# Altium schematic sheet ARM_PWR.SchDoc: Title
size A4; Date: *******; ApprovedBy: *******; CheckedBy: None; Author: *******; CompanyName: *******; DrawnBy: Jacob Chisholm; Engineer: *******; Organization: *******; Address1: *******; Address2: *******; Address3: *******; Address4: *******; DocumentNumber: 5; Revision: *******; SheetNumber: 5; SheetTotal: 9; Address_Website: https://jchisholm204.github.io; E-Mail: JacobChisholm1010@gmail.com; CurrentTime: *******; CurrentDate: *******; Time: *******; DocumentFullPathAndName: *******; DocumentName: *******; ModifiedDate: *******; ImagePath: *******; ProjectName: *******; Application_BuildNumber: *******
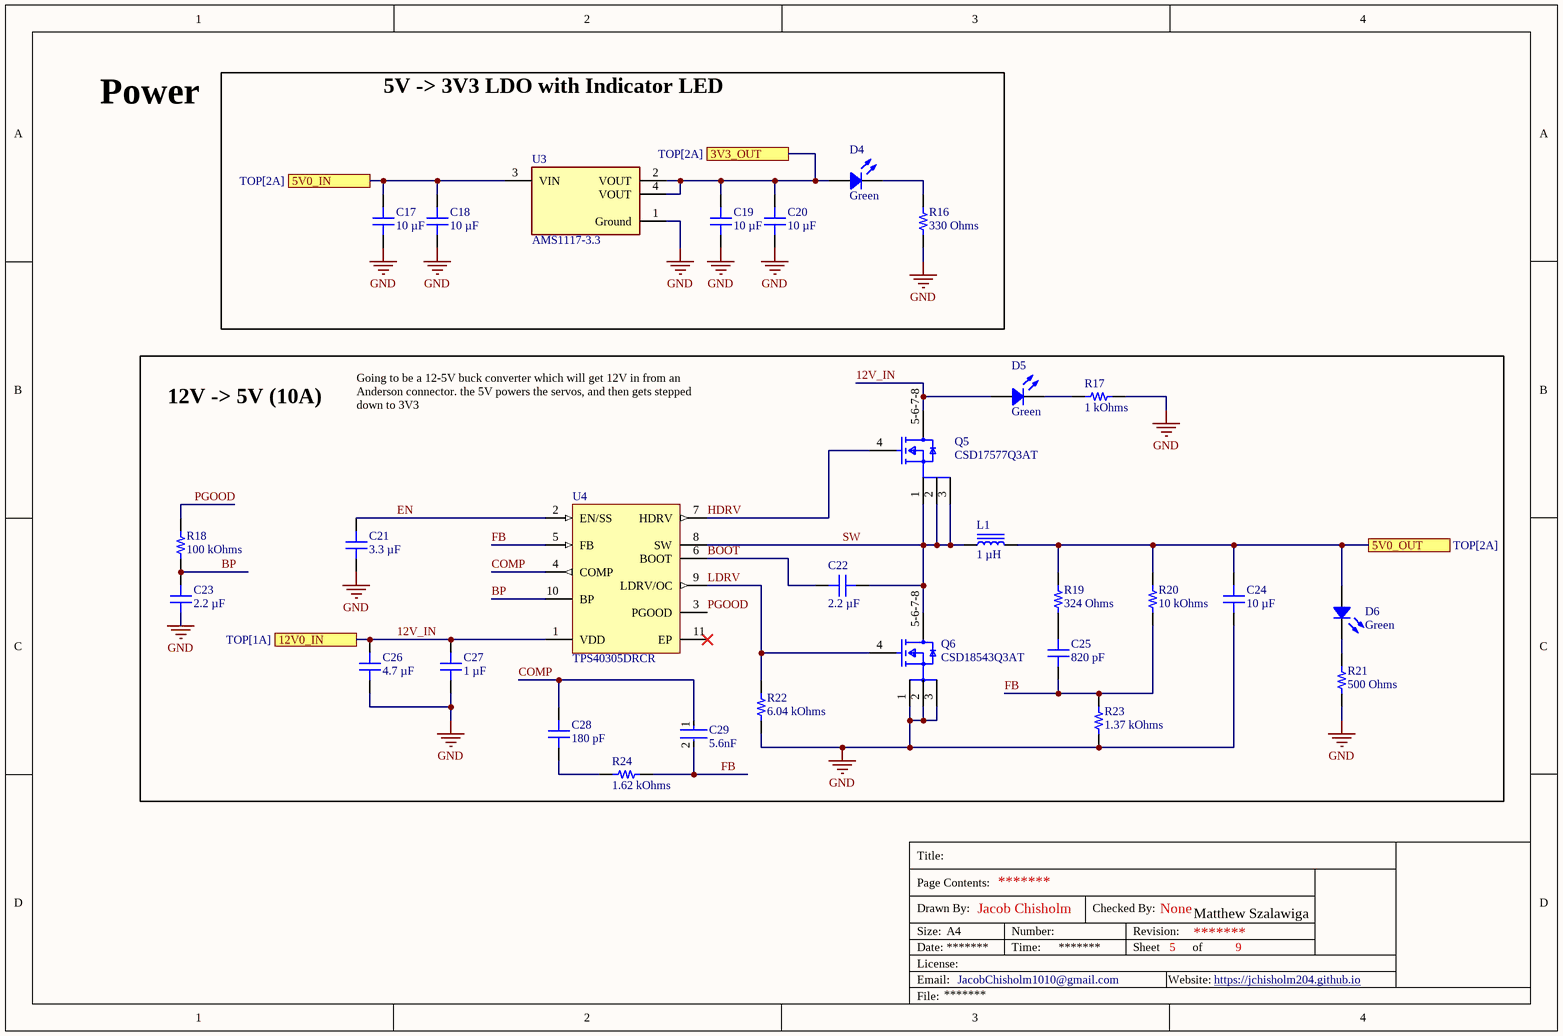
[diagram p0: ARM_PWR.SchDoc]

## Parts
C17  10 µF  [CAP 0603_1608]
C18  10 µF  [CAP 0603_1608]
C19  10 µF  [CAP 0603_1608]
C20  10 µF  [CAP 0603_1608]
C21  3.3 µF  [CAP 0603_1608]
C22  2.2 µF  [CAP 0603_1608]
C23  2.2 µF  [CAP 0603_1608]
C24  10 µF  [CAP 0603_1608]
C25  820 pF  [CAP 0603_1608]
C26  4.7 µF  [CAP 0603_1608]
C27  1 µF  [CAP 0603_1608]
C28  180 pF  [CAP 0603_1608]
C29  5.6nF  [FP-CGA4J-IPC_B]
D4  Green  [LED 0603_1608 GREEN]
D5  Green  [LED 0603_1608 GREEN]
D6  Green  [LED 0603_1608 GREEN]
L1  1 µH  [WURTH WE-HCI 7040]
Q5  CSD17577Q3AT  [FP-DNH0008A-MFG]
Q6  CSD18543Q3AT  [FP-DNH0008A-MFG]
R16  330 Ohms  [RES 0603_1608]
R17  1 kOhms  [RES 0603_1608]
R18  100 kOhms  [RES 0603_1608]
R19  324 Ohms  [RES 0603_1608]
R20  10 kOhms  [RES 0603_1608]
R21  500 Ohms  [RES 0603_1608]
R22  6.04 kOhms  [RES 0603_1608]
R23  1.37 kOhms  [RES 0603_1608]
R24  1.62 kOhms  [RES 0603_1608]
U3  AMS1117-3.3  [FP-AMS1117-IPC_C]
U4  TPS40305DRCR  [DRC0010J_V]

## Blocks framed on the sheet
5V -> 3V3 LDO with Indicator LED: C17-C20 D4 R16 U3
12V -> 5V (10A): C21-C29 D5 D6 L1 Q5 Q6 R17-R24 U4

## Ports
3V3_OUT (see TOP[2A]), 5V0_IN (see TOP[2A]), 5V0_OUT (see TOP[2A]), 12V0_IN (see TOP[1A])

## Nets
GND: C17.1 C18.1 C19.1 C20.1 C21.1 C23.1 C24.1 C26.1 C27.1 Q6.1(S) Q6.2(S) Q6.3(S) R16.1 R17.2 R21.1 R22.1 R23.1 U3.1(Ground)
3V3_OUT: C19.2 C20.2 D4.1 U3.2(VOUT) U3.4(VOUT) ; port 3V3_OUT
5V0_IN: C17.2 C18.2 U3.3(VIN) ; port 5V0_IN
5V0_OUT: C24.2 D6.1 L1.2 R19.2 R20.2 ; port 5V0_OUT
12V_IN: C26.2 C27.2 D5.1 Q5.5-6-7-8(D) U4.1(VDD) ; port 12V0_IN
BOOT: C22.1 U4.6(BOOT)
BP: C23.2 R18.1 U4.10(BP)
COMP: C28.2 C29.1 U4.4(COMP)
EN: C21.2 U4.2(EN/SS)
FB: C25.1 C29.2 R20.1 R23.2 R24.2 U4.5(FB)
HDRV: Q5.4(G) U4.7(HDRV)
LDRV: Q6.4(G) R22.2 U4.9(LDRV/OC)
PGOOD: R18.2 U4.3(PGOOD)
SW: C22.2 L1.1 Q5.1(S) Q5.2(S) Q5.3(S) Q6.5-6-7-8(D) U4.8(SW)
NetC25_2: C25.2 R19.1
NetC28_1: C28.1 R24.1
NetD4_2: D4.2 R16.2
NetD5_2: D5.2 R17.1
NetD6_2: D6.2 R21.2

Not connected (* = marked no-connect by the designer): U4 11(EP)*

## Notes on the sheet
- Power
- Going to be a 12-5V buck converter which will get 12V in from an Anderson connector. the 5V powers the servos, and then gets stepped down to 3V3
- Matthew Szalawiga
- Title:
- Drawn By:
- Page Contents:
- Checked By:
- Size:
- Date:
- File:
- License:
- Email:
- A4
- Number:
- Time:
- Revision:
- Sheet
- Website:
- of

## Library data of the parts
C17-C20 C24 = CM105X5R106K16AT: 0603 X5R 10UF10% 16V; manufacturer: KYOCERA AVX; Tolerance: ±10%; Part Number: CM105X5R106K16AT; Value: 10 µF; Applications: General Purpose; Capacitance: 10 µF; componentlink1description: Datasheet; componentlink1url: https://ele.kyocera.com/assets/products/capacitor/CM_Series_e.pdf; componentlink2description: DigiKey Link; componentlink2url: https://www.digikey.com/en/products/detail/kyocera-avx/CM105X5R106K16AT/17866311; Device Package: 0603 (1608 Metric); lastupdated: 2/9/2024 8:08:53 PM; Lifecycle Status: Active; Minimum Order: 1; Mounting Type: Surface Mount, MLCC; Operating Temperature: -55°C ~ 85°C; Package / Case: 0603 (1608 Metric); packaging: TapeAndReel; partid: 55416; Part Status: Active; price: 0.03; series: CM; Size / Dimension: 0.063" L x 0.031" W (1.60mm x 0.80mm); Supplier 1: DigiKey; Supplier Part Number 1: 478-CM105X5R106K16ATCT-ND; Temperature Coefficient: X5R; Thickness (Max): 0.039" (1.00mm); Voltage - Rated: 16V
C21 = C0603C335K9PAC7867: CAP CER 3.3UF 6.3V X5R 0603; manufacturer: KEMET; Tolerance: ±10%; Part Number: C0603C335K9PAC7867; Value: 3.3 µF; Applications: Bypass, Decoupling; Capacitance: 3.3 µF; componentlink1description: Datasheet; componentlink1url: //media.digikey.com/pdf/Data%20Sheets/Kemet%20PDFs/X5R_Dielectric_Rev_Nov2016.pdf; componentlink2description: DigiKey Link; componentlink2url: https://www.digikey.com/en/products/detail/kemet/C0603C335K9PAC7867/754743; Device Package: 0603 (1608 Metric); lastupdated: 2/9/2024 8:10:21 PM; Lifecycle Status: Active; Minimum Order: 1; Mounting Type: Surface Mount, MLCC; Operating Temperature: -55°C ~ 85°C; Package / Case: 0603 (1608 Metric); packaging: TapeAndReel; partid: 9662; Part Status: Active; price: 0.04; series: SMD Comm X5R; Size / Dimension: 0.063" L x 0.031" W (1.60mm x 0.80mm); Supplier 1: DigiKey; Supplier Part Number 1: 399-3481-1-ND; Temperature Coefficient: X5R; Thickness (Max): 0.035" (0.90mm); Voltage - Rated: 6.3V
C22 C23 = 06033D225KAT2A: 0603 25V X5R 2.2UF 10%; manufacturer: KYOCERA AVX; Part Number: 06033D225KAT2A; Value: 2.2 µF; Applications: General Purpose; Capacitance: 2.2 µF; componentlink1description: Datasheet; componentlink1url: https://datasheets.kyocera-avx.com/cx5r.pdf; componentlink2description: DigiKey Link; componentlink2url: https://www.digikey.com/en/products/detail/kyocera-avx/06033D225KAT2A/17868586; Device Package: 0603 (1608 Metric); lastupdated: 2/9/2024 8:09:42 PM; Lifecycle Status: Active; Minimum Order: 1; Mounting Type: Surface Mount, MLCC; Operating Temperature: -55°C ~ 85°C; Package / Case: 0603 (1608 Metric); packaging: TapeAndReel; partid: 48576; Part Status: Active; price: 0.07; series: -; Size / Dimension: 0.063" L x 0.032" W (1.60mm x 0.81mm); Supplier 1: DigiKey; Supplier Part Number 1: 478-06033D225KAT2ACT-ND; Temperature Coefficient: X5R; Thickness (Max): 0.037" (0.94mm); Tolerance: ±10%; Voltage - Rated: 25V
C25 = C0603C821J4HAC7867: CAP CER 820PF 16V X8R 0603; manufacturer: KEMET; Tolerance: ±5%; Part Number: C0603C821J4HAC7867; Value: 820 pF; Applications: General Purpose; Capacitance: 820 pF; componentlink1description: Datasheet; componentlink1url: https://connect.kemet.com:7667/gateway/IntelliData-ComponentDocumentation/1.0/download/datasheet/C0603C821J4HAC7867; componentlink2description: DigiKey Link; componentlink2url: https://www.digikey.com/en/products/detail/kemet/C0603C821J4HAC7867/7946714; Device Package: 0603 (1608 Metric); Features: Low ESL, High Temperature; lastupdated: 2/9/2024 8:08:42 PM; Lifecycle Status: Active; Minimum Order: 1; Mounting Type: Surface Mount, MLCC; Operating Temperature: -55°C ~ 150°C; Package / Case: 0603 (1608 Metric); packaging: TapeAndReel; partid: 56225; price: 0.01; series: SMD Comm X8R HT150C; Size / Dimension: 0.063" L x 0.031" W (1.60mm x 0.80mm); Supplier 1: DigiKey; Supplier Part Number 1: 399-C0603C821J4HAC7867CT-ND; Temperature Coefficient: X8R; Thickness (Max): 0.034" (0.87mm); Voltage - Rated: 16V
C26 = GMC10X5R475K25NT: CAP0603 X5R 4.7UF 10% 25V; manufacturer: Cal-Chip Electronics, Inc.; Part Number: GMC10X5R475K25NT; Value: 4.7 µF; Applications: General Purpose; Capacitance: 4.7 µF; componentlink1description: Datasheet; componentlink1url: https://88ce57.p3cdn1.secureserver.net/wp-content/uploads/2023/01/gmc_series-2.pdf; componentlink2description: DigiKey Link; componentlink2url: https://www.digikey.com/en/products/detail/cal-chip-electronics-inc/GMC10X5R475K25NT/18151165; Device Package: 0603 (1608 Metric); lastupdated: 2/9/2024 8:09:39 PM; Lifecycle Status: Active; Minimum Order: 1; Mounting Type: Surface Mount, MLCC; Operating Temperature: -55°C ~ 85°C; Package / Case: 0603 (1608 Metric); packaging: TapeAndReel; partid: 49827; Part Status: Active; price: 0.03; series: GMC; Size / Dimension: 0.063" L x 0.031" W (1.60mm x 0.80mm); Supplier 1: DigiKey; Supplier Part Number 1: 4713-GMC10X5R475K25NTCT-ND; Temperature Coefficient: X5R; Thickness (Max): 0.039" (1.00mm); Tolerance: ±10%; Voltage - Rated: 25V
C27 = GMC10X7R105K50NT: CAP0603 X7R 1UF 10% 50V; manufacturer: Cal-Chip Electronics, Inc.; Part Number: GMC10X7R105K50NT; Value: 1 µF; Applications: General Purpose; Capacitance: 1 µF; componentlink1description: Datasheet; componentlink1url: https://88ce57.p3cdn1.secureserver.net/wp-content/uploads/2023/01/gmc_series-2.pdf; componentlink2description: DigiKey Link; componentlink2url: https://www.digikey.com/en/products/detail/cal-chip-electronics-inc/GMC10X7R105K50NT/18151141; Device Package: 0603 (1608 Metric); lastupdated: 2/9/2024 8:09:39 PM; Lifecycle Status: Active; Minimum Order: 1; Mounting Type: Surface Mount, MLCC; Operating Temperature: -55°C ~ 125°C; Package / Case: 0603 (1608 Metric); packaging: TapeAndReel; partid: 49828; Part Status: Active; price: 0.03; series: GMC; Size / Dimension: 0.063" L x 0.031" W (1.60mm x 0.80mm); Supplier 1: DigiKey; Supplier Part Number 1: 4713-GMC10X7R105K50NTCT-ND; Temperature Coefficient: X7R; Thickness (Max): 0.037" (0.95mm); Tolerance: ±10%; Voltage - Rated: 50V
C28 = VJ0603A181GXQCW1BC: CAP CER 180PF 10V C0G/NP0 0603; manufacturer: Vishay Vitramon; Temperature Coefficient: C0G, NP0; Tolerance: ±2%; Part Number: VJ0603A181GXQCW1BC; Value: 180 pF; Applications: General Purpose; Capacitance: 180 pF; componentlink1description: Datasheet; componentlink1url: https://www.vishay.com/docs/28548/vjw1bcbascomseries.pdf; componentlink2description: DigiKey Link; componentlink2url: https://www.digikey.com/en/products/detail/vishay-vitramon/VJ0603A181GXQCW1BC/8303297; Device Package: 0603 (1608 Metric); lastupdated: 2/9/2024 8:09:53 PM; Lifecycle Status: Active; Minimum Order: 1; Mounting Type: Surface Mount, MLCC; Operating Temperature: -55°C ~ 125°C; Package / Case: 0603 (1608 Metric); packaging: TapeAndReel; partid: 34229; Part Status: Active; price: 0.02; series: VJ W1BC; Size / Dimension: 0.063" L x 0.031" W (1.60mm x 0.80mm); Supplier 1: DigiKey; Supplier Part Number 1: 720-VJ0603A181GXQCW1BCCT-ND; Thickness (Max): 0.034" (0.87mm); Voltage - Rated: 10V
C29 = CMP-08246-002383-1: Cap Ceramic 5.6nF 50V C0G 5% Pad SMD 0805 +125°C Automotive T/R; Max Operating Temperature: 125°C; Width: 0.049inch; Ratings: AEC-Q200; Voltage Rating: 50V; Dielectric: C0G; Capacitance: 5.6nF; Length: 2mm; Min Operating Temperature: -55°C; Packaging: Tape and Reel; Thickness: 0.028inch; Mount: Surface Mount; Case/Package: 0805; Composition: Ceramic; Voltage Rating (DC): 50V; Case Code (Metric): 2012; REACH SVHC: No SVHC; Package Quantity: 1; Height: 0.6mm; Tolerance: 5%; Termination: SMD/SMT; Weight: 0.000194oz; Depth: 1.25mm; Case Code (Imperial): 0805
D4-D6 = 150060GS75003: LED GREEN CLEAR 0603 SMD; Manufacturer: Würth Elektronik; Current - Test: 20mA; Lens Color: Colorless; Lens Size: 1.10mm x 0.80mm; Lens Style: Rectangle with Flat Top; Millicandela Rating: 1600mcd; Viewing Angle: 140°; Voltage - Forward (Vf) (Typ): 3.2V; Wavelength - Dominant: 525nm; Wavelength - Peak: 515nm; Part Number: 150060GS75003; Color: Green; ComponentLink1Description: Datasheet; ComponentLink1URL: https://www.we-online.com/catalog/datasheet/150060GS75003.pdf; ComponentLink2Description: DigiKey Link; ComponentLink2URL: https://www.digikey.com/en/products/detail/würth-elektronik/150060GS75003/16022170; Device Package: 0603 (1608 Metric); Height (Max): 0.80mm; LastUpdated: 6/3/2024 7:58:49 PM; Lens Transparency: Clear; Lifecycle Status: Active; Minimum Order: 1; Mounting Type: Surface Mount; Package / Case: 0603 (1608 Metric); Packaging: TapeAndReel; PartId: 1111; Part Status: Active; Price: 0.18; Series: WL-SMCW; Size / Dimension: 1.60mm L x 0.80mm W; Supplier 1: DigiKey; Supplier Part Number 1: 732-150060GS75003CT-ND; Supplier Device Package: 0603; Value: Green
L1 = 744311100: FIXED IND 1UH 15A 4.6 MOHM SMD; Manufacturer: Würth Elektronik; Current - Saturation: 19A; Frequency - Self Resonant: 85MHz; Inductance Frequency - Test: 100 kHz; Material - Core: Nonstandard; Shielding: Shielded; Tolerance: ±20%; Type: Wirewound; Part Number: 744311100; ComponentLink1Description: Datasheet; ComponentLink1URL: https://katalog.we-online.de/pbs/datasheet/744311100.pdf; ComponentLink2Description: DigiKey Link; ComponentLink2URL: https://www.digikey.com/en/products/detail/würth-elektronik/744311100/3476747; Current Rating (Amps): 15 A; DC Resistance (DCR): 4.6mOhm; Device Package: Nonstandard; Height - Seated (Max): 0.157" (4.00mm); Inductance: 1 µH; LastUpdated: 6/3/2024 8:02:48 PM; Lifecycle Status: Active; Minimum Order: 1; Mounting Type: Surface Mount; Operating Temperature: -40°C ~ 150°C; Package / Case: Nonstandard; Packaging: TapeAndReel; PartId: 260; Part Status: Active; Price: 2.72; Ratings: AEC-Q200; Series: WE-HCI; Size / Dimension: 0.276" L x 0.272" W (7.00mm x 6.90mm); Supplier 1: DigiKey; Supplier Part Number 1: 732-4177-1-ND; Supplier Device Package: 7040; Value: 1 µH
Q5 = CMP-04962-000094-1: MOSFET N-CH 30V 35A 8VSON; Number of Elements: 1; Continuous Drain Current (ID): 19A; Turn-On Delay Time: 4ns; Power Dissipation: 2.8W; Drain to Source Resistance: 5.3mR; Turn-Off Delay Time: 20ns; Max Power Dissipation: 53W; Gate to Source Voltage (Vgs): 20V; Input Capacitance: 2.31nF; Threshold Voltage: 1.4V; Element Configuration: Single; Rds On Max: 4.8mR; Rise Time: 31ns; Number of Pins: 8; RoHS Compliant: Yes; Fall Time: 4ns; Lead Free: Lead Free; Number of Channels: 1; Packaging: Tape and Reel; REACH SVHC: No SVHC; Package Quantity: 250; Drain to Source Voltage (Vdss): 30V; Contact Plating: Tin; Max Operating Temperature: 150°C; Min Operating Temperature: -40°C; Mount: Surface Mount
Q6 = CMP-04962-000006-1: 60V N-CHANNEL NEXFET POWER MOSF; Manufacturer: Texas Instruments; Turn On Delay Time: 9ns; Number Of Channels: 1; Reverse Recovery Charge: 37nC; Continuous Drain Current: 12A; Pulse Drain Current: 156A; Typ Forward Diode Voltage: 0.8V; Gate Charge At Vgs: 11.1nC @ 10V; Depletion Mode: False; Transconductance: 40S; Threshold Vgs Min: 1.5V; Max Forward Diode Voltage: 1V; Turn Off Delay Time: 8ns; Threshold Vgs Max: 2.7V; Power Dissipation: 2.8W; Max Junction Temp: +150°C; Reverse Recovery Time: 27ns; Drain To Source Resistance: 8.1mΩ; Standoff Height: 0mm; Rthja Max: 55°C/W; Input Capacitace At Vds: 885pF @ 30V; Gate To Source Voltage: 20V; Device Class L1: Discrete Semiconductors; ComponentLink2Description: Datasheet; Drain To Source Voltage: 60V; Mouser Description: Transistor: N-MOSFET; unipolar; 60V; 35A; 66W; VSONP8 3, 3x3, 3mm; RoHS: TRUE; Manufacturer Part Number: CSD18543Q3AT; Digikey Description: 60V N-CHANNEL NEXFET POWER MOSF; Lead Free: Yes; Height: 0.9mm; Device Class L3: MOSFETs; Number Of N Channels: 1; Drain To Source Breakdown Voltage: 60V; Category: Trans; Automotive: No; Package: DNH0008A; Octopart: https://octopart.com/csd18543q3at-texas+instruments-77040189; Temperature Range Low: -55°C; Device Class L2: Transistors; Temperature: -55°C to +150°C; Temperature Range High: +150°C; ComponentLink2URL: http://www.ti.com/lit/ds/symlink/csd18543q3a.pdf
R16 = ERA-3VEB3300V: RES 330 OHM 0.1% 1/8W 0603; Manufacturer: Panasonic Electronic Components; Power (Watts): 0.125W, 1/8W; Temperature Coefficient: ±25ppm/°C; Part Number: ERA-3VEB3300V; Value: 330 Ohms; ComponentLink1Description: Datasheet; ComponentLink1URL: https://b2b-api.panasonic.eu/file_stream/pids/fileversion/9152; ComponentLink2Description: DigiKey Link; ComponentLink2URL: https://www.digikey.com/en/products/detail/panasonic-electronic-components/ERA-3VEB3300V/12085193; Composition: Thin Film; Device Package: 0603 (1608 Metric); Features: Anti-Sulfur, Automotive AEC-Q200; Height - Seated (Max): 0.022" (0.55mm); LastUpdated: 2/9/2024 8:41:22 PM; Lifecycle Status: Active; Minimum Order: 1; Number of Terminations: 2; Operating Temperature: -55°C ~ 155°C; Package / Case: 0603 (1608 Metric); Packaging: TapeAndReel; PartId: 62303; Part Status: Active; Price: 0.10; Ratings: AEC-Q200; Resistance: 330 Ohms; Series: ERA-3V; Size / Dimension: 0.063" L x 0.031" W (1.60mm x 0.80mm); Supplier 1: DigiKey; Supplier Part Number 1: 10-ERA-3VEB3300VCT-ND; Supplier Device Package: 0603; Tolerance: ±0.1%
R17 = APC0603B1K00N: 1/16 WATTS PRECISION CHIP 1 KILO; Manufacturer: Ohmite; Power (Watts): 0.063W, 1/16W; Temperature Coefficient: ±25ppm/°C; Tolerance: ±0.1%; Part Number: APC0603B1K00N; Value: 1 kOhms; ComponentLink1Description: Datasheet; ComponentLink1URL: https://www.ohmite.com/assets/docs/APC-1-15.34.pdf; ComponentLink2Description: DigiKey Link; ComponentLink2URL: https://www.digikey.com/en/products/detail/ohmite/APC0603B1K00N/16369506; Composition: Thin Film; Device Package: 0603 (1608 Metric); Height - Seated (Max): 0.022" (0.55mm); LastUpdated: 2/9/2024 8:40:40 PM; Lifecycle Status: Active; Minimum Order: 1; Number of Terminations: 2; Operating Temperature: -55°C ~ 155°C; Package / Case: 0603 (1608 Metric); Packaging: TapeAndReel; PartId: 78336; Part Status: Active; Price: 0.05; Resistance: 1 kOhms; Series: APC; Size / Dimension: 0.061" L x 0.031" W (1.55mm x 0.80mm); Supplier 1: DigiKey; Supplier Part Number 1: 273-APC0603B1K00NCT-ND; Supplier Device Package: 0603
R18 = RCC0603100KFKEA: RCC0603 100 100K 1% ET1 E3; Manufacturer: Vishay Dale; Power (Watts): 0.2W, 1/5W; Temperature Coefficient: ±100ppm/°C; Part Number: RCC0603100KFKEA; Value: 100 kOhms; ComponentLink1Description: Datasheet; ComponentLink1URL: https://www.vishay.com/docs/20066/rcce3.pdf; ComponentLink2Description: DigiKey Link; ComponentLink2URL: https://www.digikey.com/en/products/detail/vishay-dale/RCC0603100KFKEA/12084243; Composition: Thick Film; Device Package: 0603 (1608 Metric); Features: Automotive AEC-Q200; Height - Seated (Max): 0.020" (0.50mm); LastUpdated: 2/9/2024 8:41:26 PM; Lifecycle Status: Active; Minimum Order: 1; Number of Terminations: 2; Operating Temperature: -55°C ~ 155°C; Package / Case: 0603 (1608 Metric); Packaging: TapeAndReel; PartId: 62891; Part Status: Active; Price: 0.01; Ratings: AEC-Q200; Resistance: 100 kOhms; Series: RCC e3; Size / Dimension: 0.061" L x 0.033" W (1.55mm x 0.85mm); Supplier 1: DigiKey; Supplier Part Number 1: 541-RCC0603100KFKEACT-ND; Supplier Device Package: 0603; Tolerance: ±1%
R19 = TNPW0603324RBEEA: RES 324 OHM 0.1% 1/10W 0603; Manufacturer: Vishay Dale; Power (Watts): 0.1W, 1/10W; Temperature Coefficient: ±25ppm/°C; Part Number: TNPW0603324RBEEA; Value: 324 Ohms; ComponentLink1Description: Datasheet; ComponentLink1URL: https://www.vishay.com/docs/28758/tnpw_e3.pdf; ComponentLink2Description: DigiKey Link; ComponentLink2URL: https://www.digikey.com/en/products/detail/vishay-dale/TNPW0603324RBEEA/1606709; Composition: Thin Film; Device Package: 0603 (1608 Metric); Features: Anti-Sulfur, Automotive AEC-Q200, Moisture Resistant; Height - Seated (Max): 0.022" (0.55mm); LastUpdated: 2/9/2024 8:40:44 PM; Lifecycle Status: Active; Minimum Order: 1; Number of Terminations: 2; Operating Temperature: -55°C ~ 155°C; Package / Case: 0603 (1608 Metric); Packaging: TapeAndReel; PartId: 75164; Part Status: Active; Price: 0.10; Ratings: AEC-Q200; Resistance: 324 Ohms; Series: TNPW e3; Size / Dimension: 0.063" L x 0.033" W (1.60mm x 0.85mm); Supplier 1: DigiKey; Supplier Part Number 1: 541-TNPW0603324RBEEACT-ND; Supplier Device Package: 0603; Tolerance: ±0.1%
R20 = TNPU060310K0AZEA00: RES 10 KOHM 0.05% 1/10W 0603; Manufacturer: Vishay Dale; Power (Watts): 0.1W, 1/10W; Temperature Coefficient: ±5ppm/°C; Part Number: TNPU060310K0AZEA00; Value: 10 kOhms; ComponentLink1Description: Datasheet; ComponentLink1URL: http://www.vishay.com/docs/28779/tnpue3.pdf; ComponentLink2Description: DigiKey Link; ComponentLink2URL: https://www.digikey.com/en/products/detail/vishay-dale/TNPU060310K0AZEA00/9448836; Composition: Thin Film; Device Package: 0603 (1608 Metric); Features: Anti-Sulfur, Automotive AEC-Q200, Moisture Resistant; Height - Seated (Max): 0.022" (0.55mm); LastUpdated: 2/9/2024 8:43:27 PM; Lifecycle Status: Active; Minimum Order: 1; Number of Terminations: 2; Operating Temperature: -55°C ~ 125°C; Package / Case: 0603 (1608 Metric); Packaging: TapeAndReel; PartId: 7195; Part Status: Active; Price: 0.93; Ratings: AEC-Q200; Resistance: 10 kOhms; Series: TNPU e3; Size / Dimension: 0.063" L x 0.033" W (1.60mm x 0.85mm); Supplier 1: DigiKey; Supplier Part Number 1: 541-4643-1-ND; Supplier Device Package: 0603; Tolerance: ±0.05%
R21 = PLT0603Z5000AST5: RES SMD 500 OHM 0.05% 0.15W 0603; Manufacturer: Vishay Thin Film; Temperature Coefficient: ±5ppm/°C; Part Number: PLT0603Z5000AST5; Value: 500 Ohms; ComponentLink1Description: Datasheet; ComponentLink1URL: http://www.vishay.com/docs/60030/plt.pdf; ComponentLink2Description: DigiKey Link; ComponentLink2URL: http://digikey.com/product-detail/en/vishay-thin-film/PLT0603Z5000AST5/PLT0603-500ACT-ND/2120409; Composition: Thin Film; Device Package: 0603 (1608 Metric); Features: Anti-Corrosive, Flame Proof, Moisture Resistant, Safety; Height - Seated (Max): 0.020" (0.51mm); LastUpdated: 2/9/2024 8:43:09 PM; Lifecycle Status: Active; Minimum Order: 1; Number of Terminations: 2; Operating Temperature: -55°C ~ 125°C; Package / Case: 0603 (1608 Metric); Packaging: TapeAndReel; PartId: 11966; Part Status: Active; Power (Watts): 0.15W; Price: 2.37; Resistance: 500 Ohms; Series: PLT; Size / Dimension: 0.064" L x 0.032" W (1.63mm x 0.81mm); Supplier 1: DigiKey; Supplier Part Number 1: PLT0603-500ACT-ND; Supplier Device Package: 0603; Tolerance: ±0.05%
R22 = TNPW06036K04BEEA: RES 6.04K OHM 0.1% 1/10W 0603; Manufacturer: Vishay Dale; Power (Watts): 0.1W, 1/10W; Temperature Coefficient: ±25ppm/°C; Part Number: TNPW06036K04BEEA; Value: 6.04 kOhms; ComponentLink1Description: Datasheet; ComponentLink1URL: http://www.vishay.com/docs/28758/tnpw_e3.pdf; ComponentLink2Description: DigiKey Link; ComponentLink2URL: https://www.digikey.com/en/products/detail/vishay-dale/TNPW06036K04BEEA/1606856; Composition: Thin Film; Device Package: 0603 (1608 Metric); Features: Anti-Sulfur, Automotive AEC-Q200, Moisture Resistant; Height - Seated (Max): 0.022" (0.55mm); LastUpdated: 2/9/2024 8:42:25 PM; Lifecycle Status: Active; Minimum Order: 1; Number of Terminations: 2; Operating Temperature: -55°C ~ 155°C; Package / Case: 0603 (1608 Metric); Packaging: TapeAndReel; PartId: 22799; Part Status: Active; Price: 0.10; Ratings: AEC-Q200; Resistance: 6.04 kOhms; Series: TNPW e3; Size / Dimension: 0.063" L x 0.033" W (1.60mm x 0.85mm); Supplier 1: DigiKey; Supplier Part Number 1: 541-3704-1-ND; Supplier Device Package: 0603; Tolerance: ±0.1%
R23 = TNPW06031K37BEEA: RES 1.37K OHM 0.1% 1/10W 0603; Manufacturer: Vishay Dale; Power (Watts): 0.1W, 1/10W; Temperature Coefficient: ±25ppm/°C; Part Number: TNPW06031K37BEEA; Value: 1.37 kOhms; ComponentLink1Description: Datasheet; ComponentLink1URL: http://www.vishay.com/docs/28758/tnpw_e3.pdf; ComponentLink2Description: DigiKey Link; ComponentLink2URL: https://www.digikey.com/en/products/detail/vishay-dale/TNPW06031K37BEEA/1606781; Composition: Thin Film; Device Package: 0603 (1608 Metric); Features: Anti-Sulfur, Automotive AEC-Q200, Moisture Resistant; Height - Seated (Max): 0.022" (0.55mm); LastUpdated: 2/9/2024 8:41:59 PM; Lifecycle Status: Active; Minimum Order: 1; Number of Terminations: 2; Operating Temperature: -55°C ~ 155°C; Package / Case: 0603 (1608 Metric); Packaging: TapeAndReel; PartId: 25753; Part Status: Active; Price: 0.10; Ratings: AEC-Q200; Resistance: 1.37 kOhms; Series: TNPW e3; Size / Dimension: 0.063" L x 0.033" W (1.60mm x 0.85mm); Supplier 1: DigiKey; Supplier Part Number 1: 541-3048-1-ND; Supplier Device Package: 0603; Tolerance: ±0.1%
R24 = TNPW06031K62BEEA: RES 1.62K OHM 0.1% 1/10W 0603; Manufacturer: Vishay Dale; Power (Watts): 0.1W, 1/10W; Temperature Coefficient: ±25ppm/°C; Part Number: TNPW06031K62BEEA; Value: 1.62 kOhms; ComponentLink1Description: Datasheet; ComponentLink1URL: http://www.vishay.com/docs/28758/tnpw_e3.pdf; ComponentLink2Description: DigiKey Link; ComponentLink2URL: https://www.digikey.com/en/products/detail/vishay-dale/TNPW06031K62BEEA/1606789; Composition: Thin Film; Device Package: 0603 (1608 Metric); Features: Anti-Sulfur, Automotive AEC-Q200, Moisture Resistant; Height - Seated (Max): 0.022" (0.55mm); LastUpdated: 2/9/2024 8:42:38 PM; Lifecycle Status: Active; Minimum Order: 1; Number of Terminations: 2; Operating Temperature: -55°C ~ 155°C; Package / Case: 0603 (1608 Metric); Packaging: TapeAndReel; PartId: 19965; Part Status: Active; Price: 0.10; Ratings: AEC-Q200; Resistance: 1.62 kOhms; Series: TNPW e3; Size / Dimension: 0.063" L x 0.033" W (1.60mm x 0.85mm); Supplier 1: DigiKey; Supplier Part Number 1: 541-3610-1-ND; Supplier Device Package: 0603; Tolerance: ±0.1%
U3 = CMP-209535-000001-1: LDO Voltage Regulators 1A, 3.3V; Manufacturer: Advanced Monolithic Systems; Dropout Voltage: 1.1V; Output Type: Fixed; Nominal Supply Current: 5mA; Max Power Dissipation: 1.2W; Max Supply Voltage: 15V; Number Of Outputs: 1; Standoff Height: 0.64mm; Max Junction Temp: +125°C; Height: 1.8mm; Package: AMS1117; Device Class L2: Power Management ICs; ComponentLink2Description: Datasheet; ComponentLink2URL: http://www.advanced-monolithic.com/pdf/ds1117.pdf; Category: IC; RoHS: TRUE; Automotive: No; Device Class L1: Integrated Circuits (ICs); Output Current: 1A; Device Class L3: Voltage Regulators - Linear; Temperature: -40°C to +125°C; Output Voltage: 3.3V; Manufacturer Part Number: AMS1117-3.3; Temperature Range Low: -40°C; Octopart: https://octopart.com/ams1117-3.3-advanced+monolithic+systems-25899300; Lead Free: Yes; Ipc Land Pattern Name: SOT229P700X180-4; Temperature Range High: +125°C
U4 = CMP-0342-00146-2: 3 to 20 V Wide Input Synchronous Buck Controller for High Power Density, High Efficiency, 1.2 MHz, 85 % Duty Cycle, -40 to 125 degC, 10-pin SON (DRC), Green (RoHS & no Sb/Br); Manufacturer: Texas Instruments; SubFamily: Step-Down Controller; Vin(Max)(V): 20; Switching Frequency(Max)(kHz): 1200; Iout(Max)(A): 25; Vin(Min)(V): 3; Duty Cycle(Max)(%): 85; Regulated Outputs(#): 1; Synchronous Rectification: TRUE; Vout(Max)(V): 17; PackageReference: DRC0010J; DatasheetVersion: SLUS964; Mounting Technology: Surface Mount; PartNumber: TPS40305DRCR; Eco-Plan: Green (RoHS & no Sb/Br); PackageDescription: 10-Pin Plastic Small Outline No-Lead, 3 x 3 x 1 mm Body, 0.5 mm Pitch, Exposed Pad; PackageVersion: revL, Sep-2011; ComponentLink2Description: Package Specification; Topology: Buck; ComponentLink1Description: Datasheet; ComponentLink1URL: http://www.ti.com/general/docs/lit/getliterature.tsp?genericPartNumber=TPS40305&fileType=pdf; ComponentLink2URL: http://www.ti.com/litv/pdf/mpds117k